# Altium schematic sheet yy_led_display.SchDoc
size A2; SheetNumber: 1; SheetTotal: 1
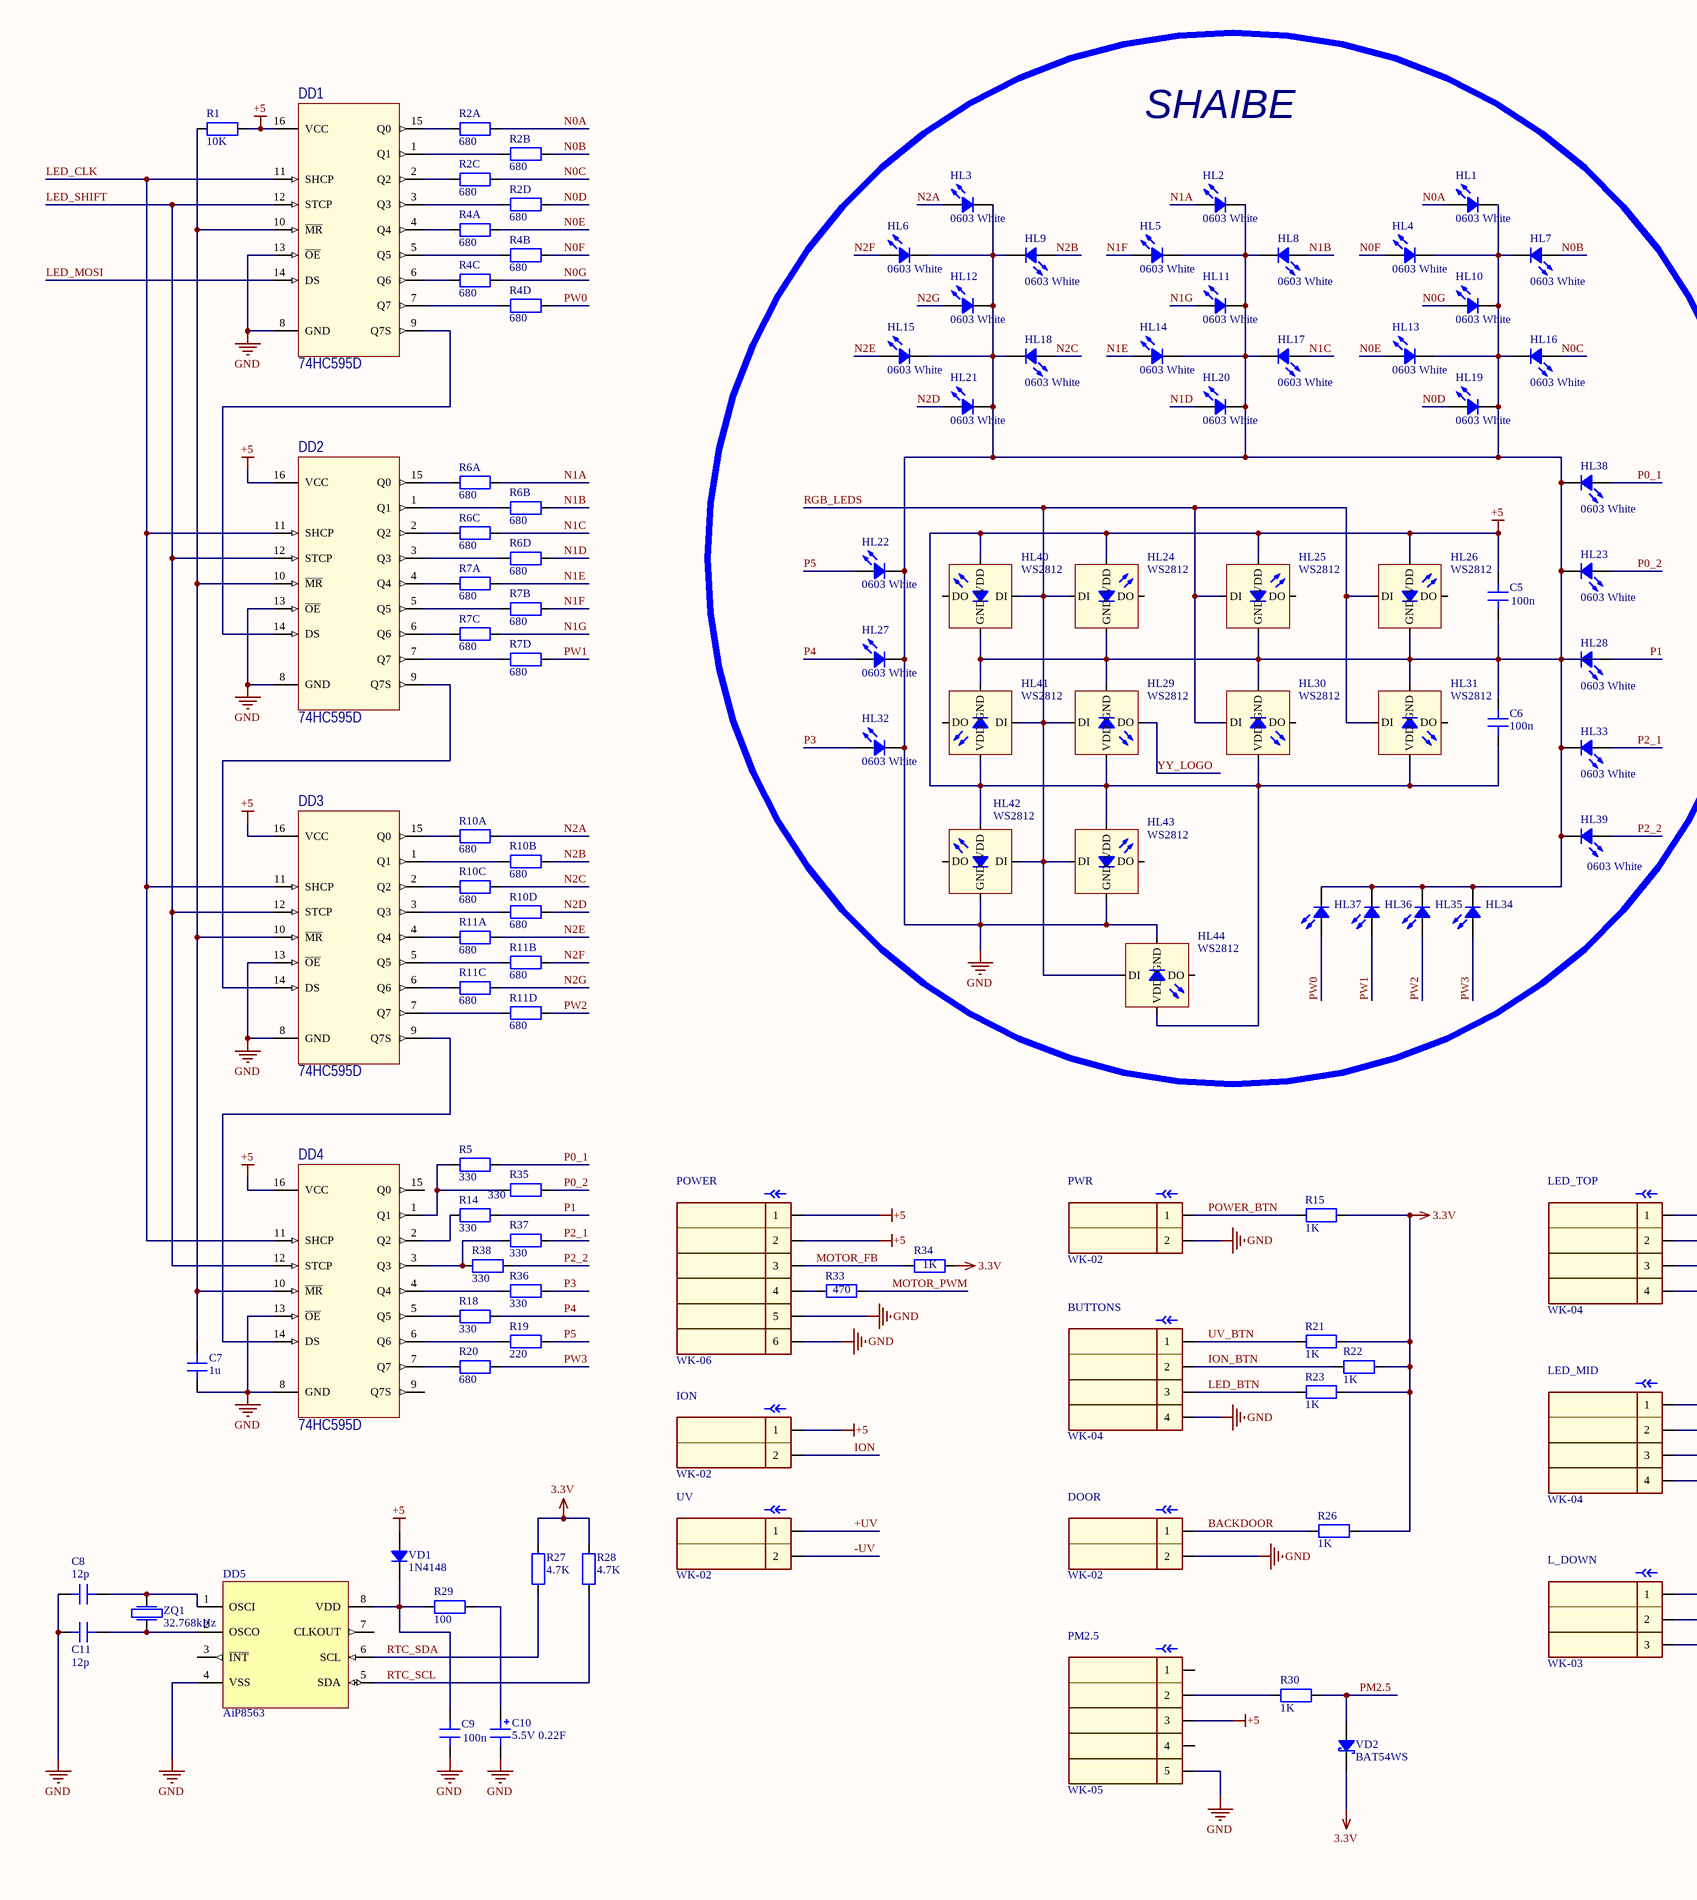
[diagram p0: yy_led_display.SchDoc, left]
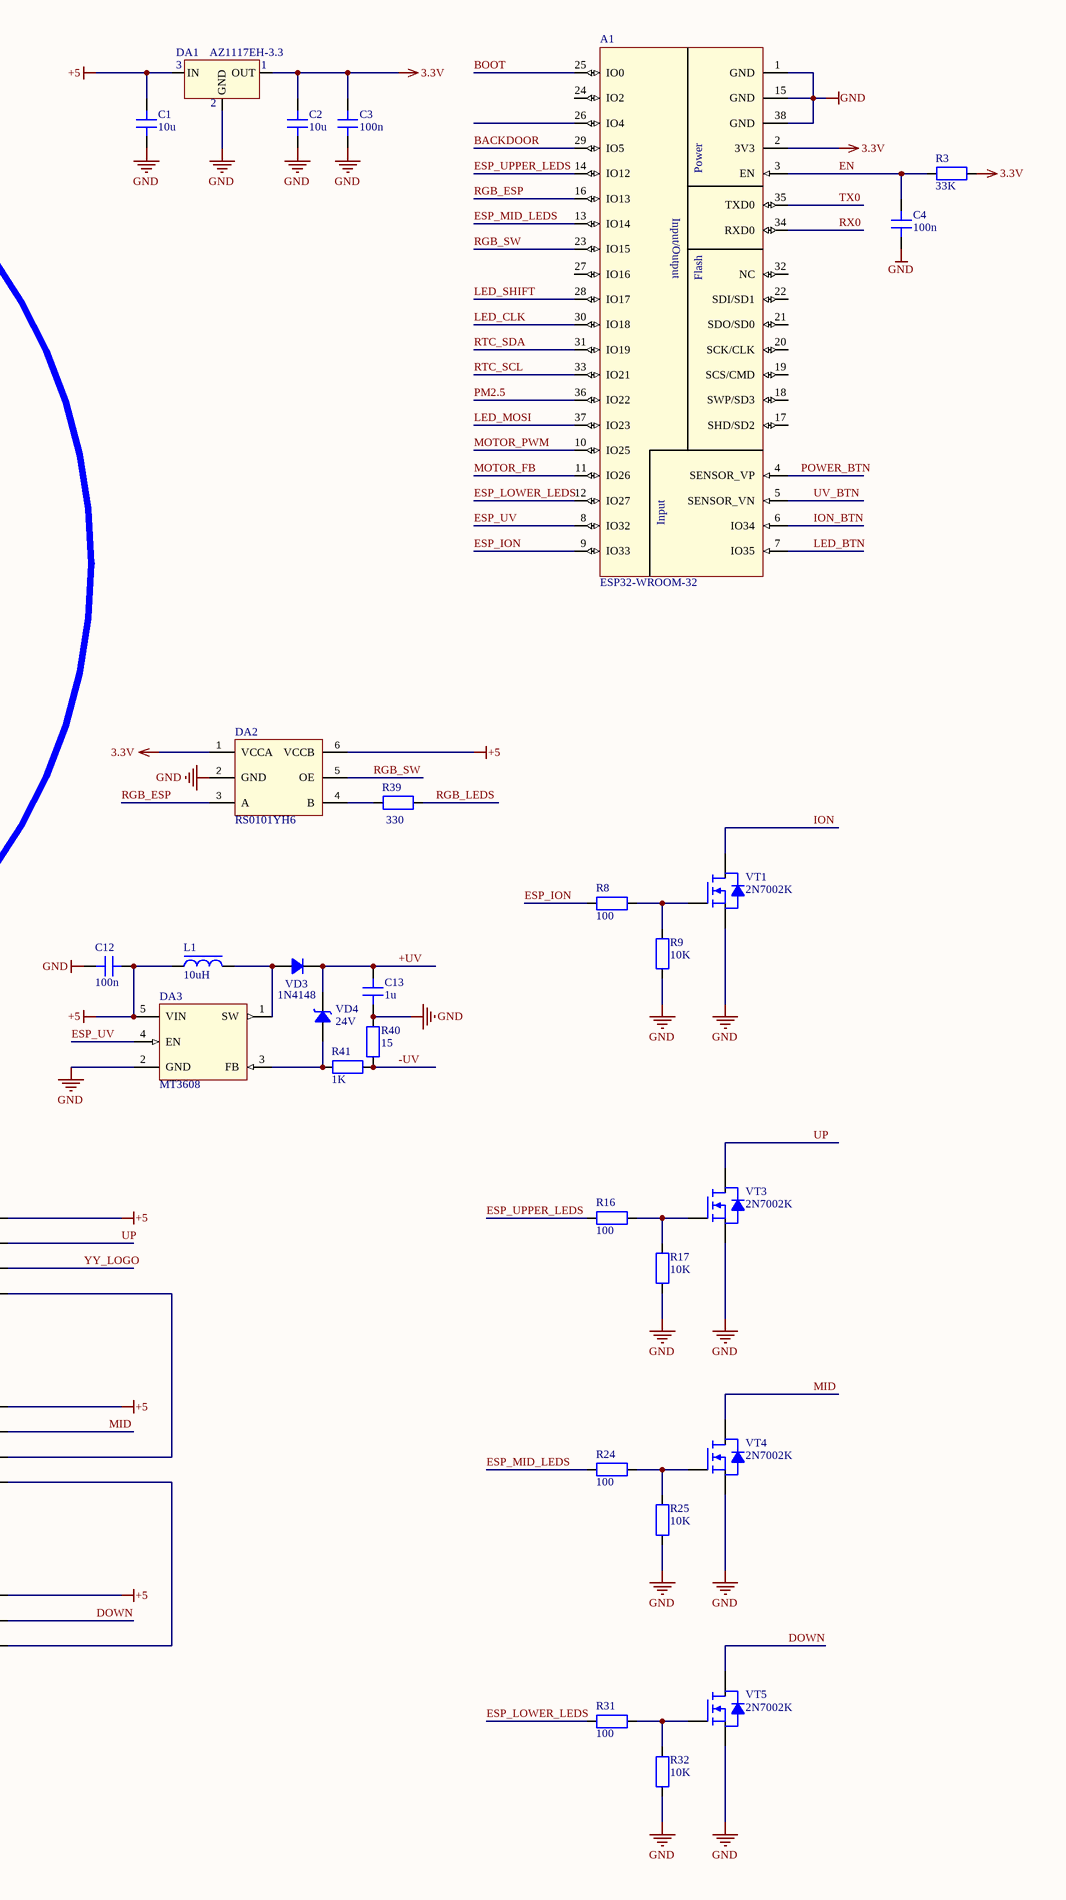
[diagram p1: yy_led_display.SchDoc, right]

## Parts
A1  ESP32-WROOM-32  [ESP-WROOM-32]
BUTTONS  WK-04  [WK-04]
C1  10u  [C0805]
C2  10u  [C0805]
C3  100n  [C0603]
C4  100n  [C0603]
C5  100n  [C0603]
C6  100n  [C0603]
C7  1u  [C0603]
C8  12p  [C0603]
C9  100n  [C0603]
C10  5.5V 0.22F  [1207H]
C11  12p  [C0603]
C12  100n  [C0603]
C13  1u  [C0603]
DA1  AZ1117EH-3.3  [SOT-223]
DA2  RS0101YH6  [SOT-23-6]
DA3  MT3608  [SOT-23-6]
DD1  74HC595D  [SO-16]
DD2  74HC595D  [SO-16]
DD3  74HC595D  [SO-16]
DD4  74HC595D  [SO-16]
DD5  AiP8563  [SO-8]
DOOR  WK-02  [WK-02]
HL1  0603 White  [LED0603Y]
HL2  0603 White  [LED0603Y]
HL3  0603 White  [LED0603Y]
HL4  0603 White  [LED0603Y]
HL5  0603 White  [LED0603Y]
HL6  0603 White  [LED0603Y]
HL7  0603 White  [LED0603Y]
HL8  0603 White  [LED0603Y]
HL9  0603 White  [LED0603Y]
HL10  0603 White  [LED0603Y]
HL11  0603 White  [LED0603Y]
HL12  0603 White  [LED0603Y]
HL13  0603 White  [LED0603Y]
HL14  0603 White  [LED0603Y]
HL15  0603 White  [LED0603Y]
HL16  0603 White  [LED0603Y]
HL17  0603 White  [LED0603Y]
HL18  0603 White  [LED0603Y]
HL19  0603 White  [LED0603Y]
HL20  0603 White  [LED0603Y]
HL21  0603 White  [LED0603Y]
HL22  0603 White  [LED0603Y]
HL23  0603 White  [LED0603Y]
HL24  WS2812  [WS2812C-2020]
HL25  WS2812  [WS2812C-2020]
HL26  WS2812  [WS2812C-2020]
HL27  0603 White  [LED0603Y]
HL28  0603 White  [LED0603Y]
HL29  WS2812  [WS2812C-2020]
HL30  WS2812  [WS2812C-2020]
HL31  WS2812  [WS2812C-2020]
HL32  0603 White  [LED0603Y]
HL33  0603 White  [LED0603Y]
HL34  0603 White  [LED0603Y]  (value not drawn)
HL35  0603 White  [LED0603Y]  (value not drawn)
HL36  0603 White  [LED0603Y]  (value not drawn)
HL37  0603 White  [LED0603Y]  (value not drawn)
HL38  0603 White  [LED0603Y]
HL39  0603 White  [LED0603Y]
HL40  WS2812  [WS2812C-2020]
HL41  WS2812  [WS2812C-2020]
HL42  WS2812  [WS2812C-2020]
HL43  WS2812  [WS2812C-2020]
HL44  WS2812  [WS2812C-2020]
ION  WK-02  [WK-02]
L1  10uH  [SCD0302_OR_L1206]
L_DOWN  WK-03  [WK-03]
LED_MID  WK-04  [WK-04]
LED_TOP  WK-04  [WK-04]
PM2.5  WK-05  [WK-05]
POWER  WK-06  [WK-06]
PWR  WK-02  [WK-02]
R1  10K  [R0603]
R2  680  [RESA_4x0402]  (parts A,B,C,D of 4)
R3  33K  [R0603]
R4  680  [RESA_4x0402]  (parts A,B,C,D of 4)
R5  330  [R0603]
R6  680  [RESA_4x0402]  (parts A,B,C,D of 4)
R7  680  [RESA_4x0402]  (parts A,B,C,D of 4)
R8  100  [R0603]
R9  10K  [R0603]
R10  680  [RESA_4x0402]  (parts A,B,C,D of 4)
R11  680  [RESA_4x0402]  (parts A,B,C,D of 4)
R14  330  [R0603]
R15  1K  [R0603]
R16  100  [R0603]
R17  10K  [R0603]
R18  330  [R0603]
R19  220  [R0603]
R20  680  [R0603]
R21  1K  [R0603]
R22  1K  [R0603]
R23  1K  [R0603]
R24  100  [R0603]
R25  10K  [R0603]
R26  1K  [R0603]
R27  4.7K  [R0603]
R28  4.7K  [R0603]
R29  100  [R0603]
R30  1K  [R0603]
R31  100  [R0603]
R32  10K  [R0603]
R33  470  [R0603]
R34  1K  [R0603]
R35  330  [R0603]
R36  330  [R0603]
R37  330  [R0603]
R38  330  [R0603]
R39  330  [R0603]
R40  15  [R0603]
R41  1K  [R0603]
UV  WK-02  [WK-02]
VD1  1N4148  [SOD-323_DIODE]
VD2  BAT54WS  [SOD-323_DIODE]
VD3  1N4148  [SOD-323_DIODE]
VD4  24V  [MiniMELF_Diode]
VT1  2N7002K  [SOT-23-3]
VT3  2N7002K  [SOT-23-3]
VT4  2N7002K  [SOT-23-3]
VT5  2N7002K  [SOT-23-3]
ZQ1  32.768kHz  [KX-327NHT]

## Nets
3.3V: A1.2(3V3) C2.2 C3.2 DA1.Y(OUT) DA2.1(VCCA) R3.2 R15.2 R21.2 R22.2 R23.2 R26.2 R27.2 R28.2 R34.2 VD2.C
+5: C1.2 C5.2 C6.1 C12.2 DA1.Z(IN) DA2.6(VCCB) DA3.5(VIN) DD1.16(VCC) DD2.16(VCC) DD3.16(VCC) DD4.16(VCC) HL24.+(VDD) HL25.+(VDD) HL26.+(VDD) HL29.+(VDD) HL30.+(VDD) HL31.+(VDD) HL40.+(VDD) HL41.+(VDD) HL42.+(VDD) HL43.+(VDD) HL44.+(VDD) ION.1 L1.1 L_DOWN.1 LED_MID.1 LED_TOP.1 PM2.5.3 POWER.1 POWER.2 R1.2 VD1.A
GND: A1.1(GND) A1.15(GND) A1.38(GND) BUTTONS.4 C1.1 C2.1 C3.1 C4.1 C5.1 C6.2 C7.1 C8.1 C9.2 C10.- C11.1 C12.1 C13.1 DA1.X(GND) DA2.2(GND) DA3.2(GND) DD1.8(GND) DD1.13(~{OE}) DD2.8(GND) DD2.13(~{OE}) DD3.8(GND) DD3.13(~{OE}) DD4.8(GND) DD4.13(~{OE}) DD5.4(VSS) DOOR.2 HL1.C HL2.C HL3.C HL4.C HL5.C HL6.C HL7.C HL8.C HL9.C HL10.C HL11.C HL12.C HL13.C HL14.C HL15.C HL16.C HL17.C HL18.C HL19.C HL20.C HL21.C HL22.C HL23.C HL24.-(GND) HL25.-(GND) HL26.-(GND) HL27.C HL28.C HL29.-(GND) HL30.-(GND) HL31.-(GND) HL32.C HL33.C HL34.C HL35.C HL36.C HL37.C HL38.C HL39.C HL40.-(GND) HL41.-(GND) HL42.-(GND) HL43.-(GND) HL44.-(GND) PM2.5.5 POWER.5 POWER.6 PWR.2 R9.1 R17.1 R25.1 R32.1 R40.1 VT1.Z(S) VT3.Z(S) VT4.Z(S) VT5.Z(S)
+UV: C13.2 UV.1 VD3.C VD4.C
-UV: R40.2 R41.2 UV.2
BACKDOOR: A1.29(IO5) DOOR.1 R26.1
BOOT: A1.25(IO0)
DOWN: L_DOWN.2 VT5.Y(D)
EN: A1.3(EN) C4.2 R3.1
ESP_ION: A1.9(IO33) R8.1
ESP_LOWER_LEDS: A1.12(IO27) R31.1
ESP_MID_LEDS: A1.13(IO14) R24.1
ESP_UPPER_LEDS: A1.14(IO12) R16.1
ESP_UV: A1.8(IO32) DA3.4(EN)
ION: ION.2 VT1.Y(D)
ION_BTN: A1.6(IO34) BUTTONS.2 R22.1
LED_BTN: A1.7(IO35) BUTTONS.3 R23.1
LED_CLK: A1.30(IO18) DD1.11(SHCP) DD2.11(SHCP) DD3.11(SHCP) DD4.11(SHCP)
LED_MOSI: A1.37(IO23) DD1.14(DS)
LED_SHIFT: A1.28(IO17) DD1.12(STCP) DD2.12(STCP) DD3.12(STCP) DD4.12(STCP)
MID: LED_MID.2 VT4.Y(D)
MOTOR_FB: A1.11(IO26) POWER.3 R34.1
MOTOR_PWM: A1.10(IO25) R33.2
N0A: HL1.A R2.A2
N0B: HL7.A R2.B2
N0C: HL16.A R2.C2
N0D: HL19.A R2.D2
N0E: HL13.A R4.A2
N0F: HL4.A R4.B2
N0G: HL10.A R4.C2
N1A: HL2.A R6.A2
N1B: HL8.A R6.B2
N1C: HL17.A R6.C2
N1D: HL20.A R6.D2
N1E: HL14.A R7.A2
N1F: HL5.A R7.B2
N1G: HL11.A R7.C2
N2A: HL3.A R10.A2
N2B: HL9.A R10.B2
N2C: HL18.A R10.C2
N2D: HL21.A R10.D2
N2E: HL15.A R11.A2
N2F: HL6.A R11.B2
N2G: HL12.A R11.C2
P0_1: HL38.A R5.2
P0_2: HL23.A R35.2
P1: HL28.A R14.2
P2_1: HL33.A R37.2
P2_2: HL39.A R38.2
P3: HL32.A R36.2
P4: HL27.A R18.2
P5: HL22.A R19.2
PM2.5: A1.36(IO22) R30.2 VD2.A
POWER_BTN: A1.4(SENSOR_VP) PWR.1 R15.1
PW0: HL37.A R4.D2
PW1: HL36.A R7.D2
PW2: HL35.A R11.D2
PW3: HL34.A R20.2
RGB_ESP: A1.16(IO13) DA2.3(A)
RGB_LEDS: HL24.I(DI) HL25.I(DI) HL26.I(DI) HL29.I(DI) HL30.I(DI) HL31.I(DI) HL40.I(DI) HL41.I(DI) HL42.I(DI) HL43.I(DI) HL44.I(DI) R39.2
RGB_SW: A1.23(IO15) DA2.5(OE)
RTC_SCL: A1.33(IO21) DD5.5(SDA) R28.1
RTC_SDA: A1.31(IO19) DD5.6(SCL) R27.1
RX0: A1.34(RXD0)
TX0: A1.35(TXD0)
UP: LED_TOP.2 VT3.Y(D)
UV_BTN: A1.5(SENSOR_VN) BUTTONS.1 R21.1
YY_LOGO: HL29.O(DO) LED_TOP.3
NetC7_2: C7.2 DD1.10(~{MR}) DD2.10(~{MR}) DD3.10(~{MR}) DD4.10(~{MR}) R1.1
NetC8_2: C8.2 DD5.1(OSCI) ZQ1.1
NetC9_1: C9.1 DD5.8(VDD) R29.1 VD1.C
NetC10_+: C10.+ R29.2
NetC11_2: C11.2 DD5.2(OSCO) ZQ1.2
NetDA2_4: DA2.4(B) R39.1
NetDA3_1: DA3.1(SW) L1.2 VD3.A
NetDA3_3: DA3.3(FB) R41.1 VD4.A
NetDD1_1: DD1.1(Q1) R2.B1
NetDD1_2: DD1.2(Q2) R2.C1
NetDD1_3: DD1.3(Q3) R2.D1
NetDD1_4: DD1.4(Q4) R4.A1
NetDD1_5: DD1.5(Q5) R4.B1
NetDD1_6: DD1.6(Q6) R4.C1
NetDD1_7: DD1.7(Q7) R4.D1
NetDD1_9: DD1.9(Q7S) DD2.14(DS)
NetDD1_15: DD1.15(Q0) R2.A1
NetDD2_1: DD2.1(Q1) R6.B1
NetDD2_2: DD2.2(Q2) R6.C1
NetDD2_3: DD2.3(Q3) R6.D1
NetDD2_4: DD2.4(Q4) R7.A1
NetDD2_5: DD2.5(Q5) R7.B1
NetDD2_6: DD2.6(Q6) R7.C1
NetDD2_7: DD2.7(Q7) R7.D1
NetDD2_9: DD2.9(Q7S) DD3.14(DS)
NetDD2_15: DD2.15(Q0) R6.A1
NetDD3_1: DD3.1(Q1) R10.B1
NetDD3_2: DD3.2(Q2) R10.C1
NetDD3_3: DD3.3(Q3) R10.D1
NetDD3_4: DD3.4(Q4) R11.A1
NetDD3_5: DD3.5(Q5) R11.B1
NetDD3_6: DD3.6(Q6) R11.C1
NetDD3_7: DD3.7(Q7) R11.D1
NetDD3_9: DD3.9(Q7S) DD4.14(DS)
NetDD3_15: DD3.15(Q0) R10.A1
NetDD4_1: DD4.1(Q1) R5.1 R35.1
NetDD4_2: DD4.2(Q2) R14.1
NetDD4_3: DD4.3(Q3) R37.1 R38.1
NetDD4_4: DD4.4(Q4) R36.1
NetDD4_5: DD4.5(Q5) R18.1
NetDD4_6: DD4.6(Q6) R19.1
NetDD4_7: DD4.7(Q7) R20.1
NetL_DOWN_3: L_DOWN.3 LED_MID.4
NetLED_MID_3: LED_MID.3 LED_TOP.4
NetPM2.5_2: PM2.5.2 R30.1
NetPOWER_4: POWER.4 R33.1
NetR8_2: R8.2 R9.2 VT1.X(G)
NetR16_2: R16.2 R17.2 VT3.X(G)
NetR24_2: R24.2 R25.2 VT4.X(G)
NetR31_2: R31.2 R32.2 VT5.X(G)

Not connected (* = marked no-connect by the designer): A1 17(SHD/SD2) 18(SWP/SD3) 19(SCS/CMD) 20(SCK/CLK) 21(SDO/SD0) 22(SDI/SD1) 24(IO2) 26(IO4) 27(IO16) 32(NC); DD4 9(Q7S) 15(Q0); DD5 3(~{INT}) 7(CLKOUT); HL24 O(DO); HL25 O(DO); HL26 O(DO); HL30 O(DO); HL31 O(DO); HL40 O(DO); HL41 O(DO); HL42 O(DO); HL43 O(DO); HL44 O(DO); PM2.5 1 4

## Notes on the sheet
- SHAIBE
- Title
- Size:
- Date:
- A3
- Number:
- Time:
- Revision:
- Sheet
- of
- File:
- (in symbol 1489) 3; 1; 2
- (in symbol 3576) Power; Input/Output; Flash; Input

## Library data of the parts
A1 = 3576: Bluetooth, WiFi 802.11b/g/n, Bluetooth v4.2 +EDR, Class 1, 2 and 3 Transceiver Module 2.4GHz ~ 2.5GHz Integrated, Trace Surface Mount; Manufacturer: Espressif Systems; ID: 3576; LCPN: C82899; Type: Modules; MFPN: ESP32-WROOM-32; Value: ESP32-WROOM-32; Footprint Type: SMD; Supplier: LC; URL: https://lcsc.com/product-detail/WIFI-Modules_Espressif-Systems-ESP32-WROOM-32_C82899.html; Symbol: ESP32-WROOM-32
BUTTONS LED_MID LED_TOP = 1450: Through-hole type shrouded header, XH Series, 2.5mm; ID: 1450; MFPN: B4B-XH-A(LF)(SN); Value: B4B-XH-A (LF) (SN) (WK-04); LCPN: C161871; Type: Connectors; Footprint Type: TH; Symbol: MALE_4PIN; Supplier: LC
C1 C2 = 1331: Cap Ceramic, 0805, ±10%, 50V, X7R (X5R), -55 +125C (-55 +85C); ID: 1331; Type: Capacitors; LCPN: C17024; Value: 10u; Footprint Type: SMD; Symbol: Capacitor
C3-C6 C9 C12 = 1234: Cap Ceramic, 0603, ±10%, 50V, X7R (X5R), -55 +125C (-55 +85C); ID: 1234; Type: Capacitors; MFPN: 0603B104K500NT; LCPN: C187860; Value: 100n; Footprint Type: SMD; URL: https://lcsc.com/product-detail/Multilayer-Ceramic-Capacitors-MLCC-SMD-SMT_YAGEO-CC0603KRX7R9BB104_C14663.html; Symbol: Capacitor
C7 C13 = 1246: Cap Ceramic, 0603, ±10%, 50V, X7R (X5R), -55 +125C (-55 +85C); ID: 1246; Type: Capacitors; MFPN: CL10A105KO8NNNC; LCPN: C1592; Value: 1u; Footprint Type: SMD; URL: https://lcsc.com/product-detail/Multilayer-Ceramic-Capacitors-MLCC-SMD-SMT_Samsung-Electro-Mechanics-CL10A105KO8NNNC_C1592.html; Symbol: Capacitor
C8 C11 = 1163: Cap Ceramic, 0603, 5%, 50V, NPO (C0G), -55 +125C; ID: 1163; Type: Capacitors; MFPN: CL10C120JB8NNNC; LCPN: C38523; Value: 12p; Footprint Type: SMD; URL: https://lcsc.com/product-detail/Multilayer-Ceramic-Capacitors-MLCC-SMD-SMT_Samsung-Electro-Mechanics-CL10C120JB8NNNC_C38523.html; Symbol: Capacitor
C10 = 3579: Ionistor 5.5V 0.22F; Manufacturer: WTSCAP (Wenting); ID: 3579; Type: Capacitors; MFPN: WTC5V50F22Z-0510H; LCPN: C389744; Value: 5.5V 0.22F; Footprint Type: TH; Supplier: LC; URL: https://item.szlcsc.com/365848.html; Symbol: Capacitor_polarised
DA1 = 1489: IC, Vreg, LDO, For Low ESR MLCC Cout, SOT223; ID: 1489; MFPN: AZ1117EH-3.3TRG1; LCPN: C108494; Type: Microschemes; Value: AZ1117EH-3.3; Footprint Type: SMD; Supplier: JLC; URL: https://lcsc.com/product-detail/Low-Dropout-Regulators-LDO_DIODES_AZ1117EH-3-3TRG1_AZ1117EH-3-3TRG1_C108494.html; Symbol: LDO_1117
DA2 = 3597: Level Translators, Shifters RoHS; Manufacturer: Jiangsu RUNIC Tech; ID: 3597; LCPN: C2762287; Type: Microschemes; MFPN: RS0101YH6; Value: RS0101YH6; Footprint Type: SMD; Supplier: LC; URL: https://lcsc.com/product-detail/Level-Translators-Shifters_Jiangsu-RUNIC-Tech-RS0101YH6_C2762287.html; Symbol: RS0101YH6
DA3 = 3587: High Efficiency 1.2MHz 2A Step Up Converter; Manufacturer: XI'AN Aerosemi Tech; ID: 3587; LCPN: C84817; Type: Microschemes; MFPN: MT3608; Value: MT3608; Footprint Type: SMD; Supplier: LC; URL: https://lcsc.com/product-detail/DC-DC-Converters_XI-AN-Aerosemi-Tech-MT3608_C84817.html; Symbol: MT3608
DD1-DD4 = 3557: Shift Register Serial to parallel, serial SOIC-16_150mil; Manufacturer: Shenzhen Fuman Elec; ID: 3557; MFPN: 74HC595D,118; LCPN: C2798023; Type: Microschemes; Value: 74HC595D; Footprint Type: SMD; Supplier: LC; URL: https://lcsc.com/product-detail/74-Series_Nexperia-74HC595D-118_C5947.html; Symbol: 74HC595D
DD5 = 3578: SOP-8 Real-time Clocks RoHS; Manufacturer: Wuxi I-core Elec; ID: 3578; LCPN: C116087; Type: Microschemes; MFPN: AiP8563; Value: AiP8563; Footprint Type: SMD; Supplier: LC; Symbol: AiP8563
DOOR ION PWR UV = 1448: Through-hole type shrouded header, XH Series, 2.5mm; ID: 1448; MFPN: B2B-XH-A(LF)(SN); Value: B2B-XH-A (LF) (SN) (WK-02); LCPN: C158012; Type: Connectors; Footprint Type: TH; Supplier: JLC; URL: https://lcsc.com/product-detail/Wire-To-Board-Wire-To-Wire-Connector_JST-Sales-America_B2B-XH-A-LF-SN_JST-Sales-America-B2B-XH-A-LF-SN_C158012.html; Symbol: MALE_2PIN
HL1-HL23 HL27 HL28 HL32-HL39 = 3559: LED, SMD 0603, 20mA, White 6000K~7000K; Manufacturer: HONGLITRONIC(Hongli Zhihui (HONGLITRONIC)); ID: 3559; MFPN: HL-PT-1608H322W-L(6000K-7000K); LCPN: C205448; Type: LED; Value: 0603 White; Footprint Type: SMD; Supplier: LC; URL: https://lcsc.com/product-detail/New-Arrivals_HONGLITRONIC-Hongli-Zhihui-HONGLITRONIC-HL-PT-1608H322W-L-6000K-7000K_C497920.html; Symbol: LED
HL24-HL26 HL29-HL31 HL40-HL44 = 3562: Intelligent control LED, 2.0x2.0mm; Manufacturer: Worldsemi; ID: 3562; Value: WS2812C-2020; LCPN: C965556; Type: LED; MFPN: WS2812C-2020; Footprint Type: SMD; Supplier: LC; URL: https://lcsc.com/product-detail/Light-Emitting-Diodes-LED_Worldsemi-WS2812C-2020_C965556.html; Symbol: WS2812C-2020
L1 = 3600: SMD Power Inductors, 10uH ±20% 350mA 350mΩ SMD,3.5x3x2.1mm; Manufacturer: Sunltech Tech; ID: 3600; MFPN: SLF0302-100MTT; LCPN: C182190; Type: Inductors; Value: 10uH; Footprint Type: SMD; Supplier: LC; URL: https://lcsc.com/product-detail/Power-Inductors_Sunltech-Tech-SLF0302-100MTT_C182190.html; Symbol: Drossel; Footprint: SCD0302
L_DOWN = 1449: Through-hole type shrouded header, XH Series, 2.5mm; ID: 1449; MFPN: B3B-XH-A(LF)(SN); Value: B3B-XH-A (LF) (SN) (WK-03); LCPN: C144394; Type: Connectors; Footprint Type: TH; Supplier: LC; Symbol: MALE_3PIN
PM2.5 = 1451: Through-hole type shrouded header, XH Series, 2.5mm; ID: 1451; MFPN: B5B-XH-A(LF)(SN); Value: B5B-XH-A (LF) (SN) (WK-05); LCPN: C157991; Type: Connectors; Footprint Type: TH; Symbol: MALE_5PIN; Supplier: LC
POWER = 1452: Through-hole type shrouded header, XH Series, 2.5mm; ID: 1452; MFPN: B6B-XH-A(LF)(SN); Value: B6B-XH-A (LF) (SN) (WK-06); LCPN: C144397; Type: Connectors; Footprint Type: TH; Supplier: LC; Symbol: MALE_6PIN
R1 R9 R17 R25 R32 = 97: Res, 0603, 1%, 1/10W; Manufacturer: FH(Guangdong Fenghua Advanced Tech); ID: 97; MFPN: RS-03K1002FT; LCPN: C115324; Type: Resistors; Value: 10K; Footprint Type: SMD; Supplier: JLC; URL: https://lcsc.com/product-detail/Chip-Resistor-Surface-Mount_FH-Guangdong-Fenghua-Advanced-Tech-RS-03K1002FT_C115324.html; Symbol: Resistor
R2 R4 R6 R7 R10 R11 = 3602: 680 ±5% 4 1/16W ±200ppm/℃ 0402_x4 Resistor Networks & Arrays RoHS; Manufacturer: RALEC; ID: 3602; MFPN: RTA02-4D681JTH; LCPN: C458651; Type: Resistors; Value: 680; Footprint Type: SMD; Supplier: LC; URL: https://lcsc.com/product-detail/Resistor-Networks-Arrays_RALEC-RTA02-4D681JTH_C458651.html; Symbol: Resistor_array_4
R3 = 109: Res, 0603, 1%, 1/10W; Manufacturer: UNI-ROYAL(Uniroyal Elec); ID: 109; MFPN: 0603WAF3302T5E; LCPN: C4216; Type: Resistors; Value: 33K; Footprint Type: SMD; Supplier: JLC; URL: https://lcsc.com/product-detail/Chip-Resistor-Surface-Mount_UNI-ROYAL-Uniroyal-Elec-0603WAF3302T5E_C4216.html; Symbol: Resistor
R5 R14 R18 R35-R39 = 61: Res, 0603, 1%, 1/10W; Manufacturer: Walsin Tech Corp; ID: 61; MFPN: WR06X3300FTL; LCPN: C163905; Type: Resistors; Value: 330; Footprint Type: SMD; Supplier: JLC; URL: https://lcsc.com/product-detail/Chip-Resistor-Surface-Mount_Walsin-Tech-Corp-WR06X3300FTL_C163905.html; Symbol: Resistor
R8 R16 R24 R29 R31 = 49: Res, 0603, 1%, 1/10W; Manufacturer: UNI-ROYAL(Uniroyal Elec); ID: 49; MFPN: 0603WAF1000T5E; LCPN: C22775; Type: Resistors; Value: 100; Footprint Type: SMD; Supplier: JLC; URL: https://lcsc.com/product-detail/Chip-Resistor-Surface-Mount_UNI-ROYAL-Uniroyal-Elec-0603WAF1000T5E_C22775.html; Symbol: Resistor
R15 R21-R23 R26 R30 R34 R41 = 73: Res, 0603, 1%, 1/10W; Manufacturer: FH(Guangdong Fenghua Advanced Tech); ID: 73; MFPN: RS-03K1002FT; LCPN: C115325; Type: Resistors; Value: 1K; Footprint Type: SMD; Supplier: JLC; URL: https://lcsc.com/product-detail/Chip-Resistor-Surface-Mount_FH-Guangdong-Fenghua-Advanced-Tech-RS-03K1001FT_C115325.html; Symbol: Resistor
R19 = 57: Res, 0603, 1%, 1/10W; Manufacturer: UNI-ROYAL(Uniroyal Elec); ID: 57; MFPN: 0603WAF2200T5E; LCPN: C22962; Type: Resistors; Value: 220; Footprint Type: SMD; Supplier: JLC; URL: https://lcsc.com/product-detail/Chip-Resistor-Surface-Mount_UNI-ROYAL-Uniroyal-Elec-0603WAF2200T5E_C22962.html; Symbol: Resistor
R20 = 69: Res, 0603, 1%, 1/10W; Manufacturer: UNI-ROYAL(Uniroyal Elec); ID: 69; MFPN: 0603WAF6800T5E; LCPN: C23228; Type: Resistors; Value: 680; Footprint Type: SMD; Supplier: JLC; URL: https://lcsc.com/product-detail/Chip-Resistor-Surface-Mount_UNI-ROYAL-Uniroyal-Elec-0603WAF6800T5E_C23228.html; Symbol: Resistor
R27 R28 = 89: Res, 0603, 1%, 1/10W; Manufacturer: UNI-ROYAL(Uniroyal Elec); ID: 89; MFPN: 0603WAF4701T5E; LCPN: C23162; Type: Resistors; Value: 4.7K; Footprint Type: SMD; Supplier: JLC; URL: https://lcsc.com/product-detail/Chip-Resistor-Surface-Mount_UNI-ROYAL-Uniroyal-Elec-0603WAF4701T5E_C23162.html; Symbol: Resistor
R33 = 65: Res, 0603, 1%, 1/10W; Manufacturer: FH(Guangdong Fenghua Advanced Tech); ID: 65; MFPN: RS-03K4700FT; LCPN: C116694; Type: Resistors; Value: 470; Footprint Type: SMD; Supplier: JLC; URL: https://lcsc.com/product-detail/Chip-Resistor-Surface-Mount_FH-Guangdong-Fenghua-Advanced-Tech-RS-03K4700FT_C116694.html; Symbol: Resistor
R40 = 29: Res, 0603, 1%, 1/10W; Manufacturer: UNI-ROYAL(Uniroyal Elec); ID: 29; MFPN: 0603WAF150JT5E; LCPN: C22810; Type: Resistors; Value: 15; Footprint Type: SMD; Supplier: JLC; URL: https://lcsc.com/product-detail/Chip-Resistor-Surface-Mount_UNI-ROYAL-Uniroyal-Elec-0603WAF150JT5E_C22810.html; Symbol: Resistor
VD1 VD3 = 1464: Small Signal Fast Switching Diode, 150mA, 75V; ID: 1464; Type: Diodes; MFPN: 1N4148WS; Value: 1N4148WS; LCPN: C108805; Footprint Type: SMD; Supplier: JLC; URL: https://lcsc.com/product-detail/Switching-Diode_Shandong-Jingdao-Microelectronics-1N4148WS_C108805.html; Symbol: Diode
VD2 = 3582: 30V 100mA 1V @ 100mA SOD-323 Schottky Barrier Diodes (SBD) RoHS; Manufacturer: LGE; ID: 3582; LCPN: C402232; Type: Diodes; MFPN: BAT54WS; Value: BAT54WS; Footprint Type: SMD; Supplier: LC; URL: https://lcsc.com/product-detail/Schottky-Barrier-Diodes-SBD_LGE-BAT54WS_C402232.html; Symbol: Shottky
VD4 = 3599: Zener Diode, 24V, 500mW, 0.1uA, LL-34; Manufacturer: ST(Semtech); ID: 3599; Type: Diodes; MFPN: ZMM24; LCPN: C8074; Value: 24V; Footprint Type: SMD; Supplier: LC; URL: https://lcsc.com/product-detail/Zener-Diodes_ST-Semtech-ZMM24_C8074.html; Symbol: Zener_TVS
VT1 VT3-VT5 = 1471: HEXFET Power MOSFET N-CH; ID: 1471; Type: Transistors; LCPN: C38161; MFPN: 2N7002K; Value: 2N7002K; Footprint Type: SMD; Supplier: LC; URL: https://lcsc.com/product-detail/MOSFET_Changjiang-Electronics-Tech-CJ-2N7002K_C38161.html; Symbol: N-MOS
ZQ1 = 1504: Quartz 32.768kHz 12.5pF 20ppm; ID: 1504; MFPN: FC-135 32.768000kHz 12.5 +20.0-20.0; LCPN: C164062; Type: Quartzes; Value: 32.768kHz; Footprint Type: SMD; Supplier: JLC; URL: https://lcsc.com/product-detail/SMD-Crystal-Resonators_TAE-Zhejiang-Abel-Elec-SMD-3215-2P32-768KHZ12-5PF10PPM_C164062.html; Symbol: QUARTZ